# Altium schematic sheet ESP32-C3-WROOM-2.SchDoc
size A4; SheetNumber: 2; SheetTotal: 5
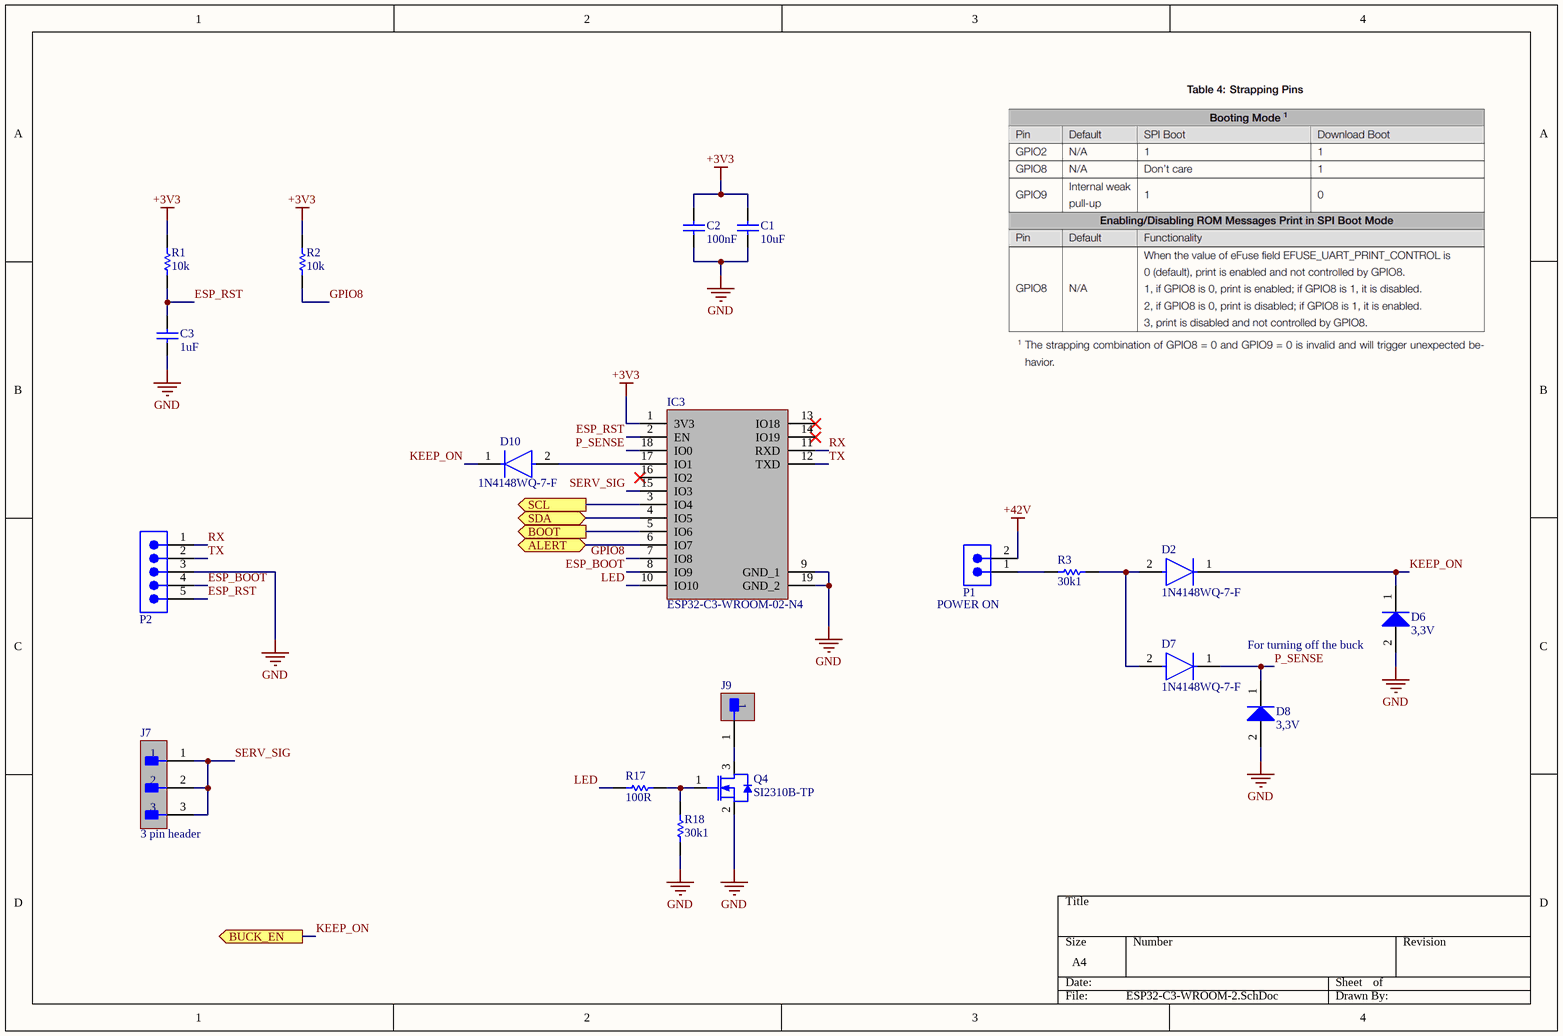
[diagram p0: ESP32-C3-WROOM-2.SchDoc]

## Parts
C1  value 10uF  [Wurth 0603 capacitor]  (hidden comment: Generic Capacitor 10uF 0603)
C2  value 100nF  [Wurth 0603 capacitor]  (hidden comment: Generic Capacitor 100nF 0603)
C3  value 1uF  [Wurth 0603 capacitor]  (hidden comment: Generic Capacitor 1uF 0603)
D2  1N4148WQ-7-F  [FP-SOD123-MFG]
D6  value 3,3V  [SOD-123]  (hidden comment: BZT52C3V3)
D7  1N4148WQ-7-F  [FP-SOD123-MFG]
D8  value 3,3V  [SOD-123]  (hidden comment: BZT52C3V3)
D10  1N4148WQ-7-F  [FP-SOD123-MFG]
IC3  ESP32-C3-WROOM-02-N4  [Espressif ESP32C3WROOM02N4]
J7  3 pin header  [3 pin header 2.54mm]
J9  1 pin header  [1 pin header]  (value not drawn)
P1  POWER ON  [2x1 2.54mm M]
P2  61300511121  [5x1 2.54mm]  (value not drawn)
Q4  SI2310B-TP  [MCC SOT-23-3]
R1  value 10k  [Wurth 0603 Resistor]  (hidden comment: Generic Resistor 10k 0603)
R2  value 10k  [Wurth 0603 Resistor]  (hidden comment: Generic Resistor 10k 0603)
R3  value 30k1  [Wurth 0603 Resistor]  (hidden comment: Generic Resistor 30k1 0603)
R17  value 100R  [Wurth 0603 Resistor]  (hidden comment: Generic Resistor 100R 0603)
R18  value 30k1  [Wurth 0603 Resistor]  (hidden comment: Generic Resistor 30k1 0603)

## Ports
ALERT (bidir), BOOT (out), BUCK_EN (out), SCL (out), SDA (bidir)

## Nets
+3V3: C1.2 C2.2 IC3.1(3V3) R1.2 R2.2
+42V: P1.2
GND: C1.1 C2.1 C3.1 D6.2(A) D8.2(A) IC3.9(GND_1) IC3.19(GND_2) P2.3 Q4.2(S) R18.1
ALERT: IC3.6(IO7) ; port ALERT
BOOT: IC3.5(IO6) ; port BOOT
ESP_BOOT: IC3.8(IO9) P2.4
ESP_RST: C3.2 IC3.2(EN) P2.5 R1.1
GPIO8: IC3.7(IO8) R2.1
KEEP_ON: D2.1(C) D6.1(K) D10.1(C) ; port BUCK_EN
LED: IC3.10(IO10) R17.1
P_SENSE: D7.1(C) D8.1(K) IC3.18(IO0)
RX: IC3.11(RXD) P2.1
SCL: IC3.3(IO4) ; port SCL
SDA: IC3.4(IO5) ; port SDA
SERV_SIG: IC3.15(IO3) J7.1 J7.2 J7.3
TX: IC3.12(TXD) P2.2
NetD2_2: D2.2(A) D7.2(A) R3.2
NetD10_2: D10.2(A) IC3.17(IO1)
NetJ9_1: J9.1 Q4.3(D)
NetP1_1: P1.1 R3.1
NetQ4_1: Q4.1(G) R17.2 R18.2

Not connected (* = marked no-connect by the designer): IC3 13(IO18)* 14(IO19)* 16(IO2)*

## Notes on the sheet
- (near D6) For turning off the buck

## Library data of the parts
D2 D7 D10 = CMP-12791-000025-1: DIODE GEN PURP 100V 300MA SOD123; Manufacturer: Diodes Inc.; Value: 2pF; Standoff Height: 0mm; Automotive Grade: Grade 0; Max Junction Temp: +150°C; Max Surge Forward Current: 1A; Peak Reverse Current: 1uA; Forward Current: 300mA; Temperature: -65°C to +150°C; Device Class L3: Rectifier Diodes; Manufacturer Part Number: 1N4148WQ-7-F; Temperature Range Low: -65°C; Device Class L1: Discrete Semiconductors; Reverse Voltage: 100V; Automotive: Yes; Temperature Range High: +150°C; Octopart: https://octopart.com/1n4148wq-7-f-diodes+inc.-34965875; ComponentLink2URL: https://www.diodes.com/assets/Datasheets/ds30086.pdf; Max Repetitive Reverse Voltage: 100V; Mouser Description: Diode Switching 100V 0.15A Automotive 2-Pin SOD-123 T/R; Ipc Land Pattern Name: SOD365155X123-2; RoHS: TRUE; Height: 1.45mm; ComponentLink2Description: Datasheet; Category: Diode; Footprint Url: https://www.diodes.com/assets/Package-Files/SOD123.pdf; Package: SOD123; Device Class L2: Diodes; Lead Free: Yes; Capacitance: 2pF; Digikey Description: DIODE GEN PURP 100V 300MA SOD123
D6 D8 = GOODWORK BZT52C3V3
IC3 = Espressif ESP32-C3-WROOM-02-N4: Integrated Circuit; Manufacturer_Name: Espressif Systems; Datasheet Link: https://www.mouser.ch/datasheet/2/891/Espressif_ESP32_C3_WROOM_02-2006871.pdf; Height: 3.35mm; Manufacturer_Part_Number: ESP32-C3-WROOM-02-N4; Mouser Part Number: 356-ESP32C3WROOM02N4; Mouser Price/Stock: https://www.mouser.co.uk/ProductDetail/Espressif-Systems/ESP32-C3-WROOM-02-N4?qs=stqOd1AaK7%2FqjTZKEOgfUg%3D%3D; Supplier: Mouser; Supplier Part Number: 356-ESP32C3WROOM02N4
P1 = 2P: WR-PHD Pin Header, THT, Vertical, pitch 2.54mm, 1 Row, 2P; Manufacturer Part Number: 61300211121; Manufacturer: Wurth Elektronik; Contact Resistance: 20mOhm; Rated Current: 3A; Working Voltage: 250V; Withstanding Voltage: 500V; Category: Board-to-Board Connectors; Match Code: WR-PHD; ComponentLink1Description: Website Link; ComponentLink1URL: https://www.we-online.com/redexpert/article/61300211121?ad; ComponentLink2Description: Datasheet Link; ComponentLink2URL: https://www.we-online.com/redexpert/spec/61300211121?ad; Mount: Through Hole; Operating Temperature Max: 105°C; Operating Temperature Min: -40°C; Packaging: Bag; Gender: Pin Header; Number of Pins: 2; Number of Rows: 1; Orientation: Vertical; Pitch: 2.54mm
P2 = 5P: WR-PHD Pin Header, THT, Vertical, pitch 2.54mm, 1 Row, 5P; Manufacturer: Wurth Elektronik; Contact Resistance: 20mOhm; Rated Current: 3A; Working Voltage: 250V; Withstanding Voltage: 500V; Manufacturer Part Number: 61300511121; Category: Board-to-Board Connectors; Match Code: WR-PHD; ComponentLink1Description: Website Link; ComponentLink1URL: https://www.we-online.com/redexpert/article/61300511121?ad; ComponentLink2Description: Datasheet Link; ComponentLink2URL: https://www.we-online.com/redexpert/spec/61300511121?ad; Mount: Through Hole; Operating Temperature Max: 105°C; Operating Temperature Min: -40°C; Packaging: Bag; Gender: Pin Header; Number of Pins: 5; Number of Rows: 1; Orientation: Vertical; Pitch: 2.54mm
Q4 = MCC SI2310B-TP: Power Field-Effect Transistor; Manufacturer: MCC; Supplier: Digikey; Supplier Part Number: 353-SI2310B-TPCT-ND; Manufacturer Part Number: SI2310B-TP; RoHS: Yes; Stock: 114263; Pricing: 1=0,36, 10=0,255, 100=0,1286, 500=0,10488, 1000=0,07782 (USD)